# EAGLE schematic CockCroftMultiplier (EAGLE 9.5.1)
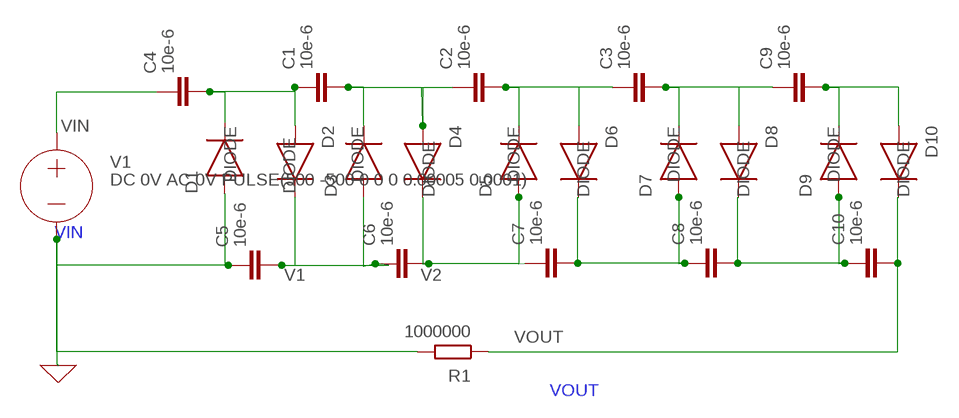
[diagram p0: schematic, sheet 1]

## Parts
C1  10e-6  C  (no package)
C2  10e-6  C  (no package)
C3  10e-6  C  (no package)
C4  10e-6  C  (no package)
C5  10e-6  C  (no package)
C6  10e-6  C  (no package)
C7  10e-6  C  (no package)
C8  10e-6  C  (no package)
C9  10e-6  C  (no package)
C10  10e-6  C  (no package)
D1  DIODE  (no package)
D2  DIODE  (no package)
D3  DIODE  (no package)
D4  DIODE  (no package)
D5  DIODE  (no package)
D6  DIODE  (no package)
D7  DIODE  (no package)
D8  DIODE  (no package)
D9  DIODE  (no package)
D10  DIODE  (no package)
R1  1000000  R  (no package)
V1  DC 0V AC 0V PULSE(500 -500 0 0 0 0.00005 0.0001)  VOLTAGE  (no package)

## Nets
0: C5.1 D1.A R1.2 V1.- ; supply symbol labelled GND
N$2: C1.2 C2.1 D3.C D4.A
N$3: C1.1 C4.2 D1.C D2.A
N$5: C3.2 C9.1 D7.C D8.A
N$7: C2.2 C3.1 D5.C D6.A
N$8: C9.2 D9.C D10.A
V1: C5.2 C6.1 D2.C D3.A
V2: C6.2 C7.1 D4.C D5.A
V3: C7.2 C8.1 D6.C D7.A
V4: C8.2 C10.1 D8.C D9.A
VIN: C4.1 V1.+
VOUT: C10.2 D10.C R1.1

## Library data of the parts
C1-C10 = ngspice-simulation:C: CAPACITOR; SPICEPREFIX: C
D1-D10 = ngspice-simulation:DIODE: Diode; SPICEPREFIX: D
R1 = ngspice-simulation:R: RESISTOR; SPICEPREFIX: R
V1 = ngspice-simulation:VOLTAGE: Independent Voltage Source, either DC, AC, PULSE, SINE, PWL, EXP, or SFFM; VALUE: 0V